# Altium schematic sheet Sensor_interfacing.SchDoc
size 76 x 76 mm; SheetNumber: 5; SheetTotal: 6
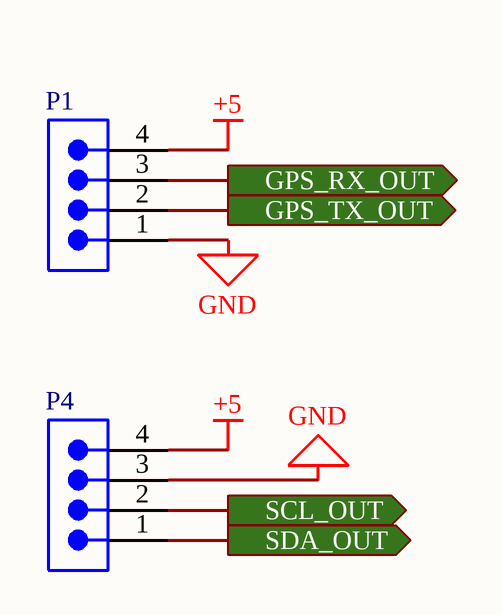
[diagram p0: Sensor_interfacing.SchDoc]

## Parts
P1  61300411121  [61300411121]  (value not drawn)
P4  61300411121  [61300411121]  (value not drawn)

## Ports
GPS_RX_OUT (out, see Top_domain[3C]), GPS_TX_OUT (out, see Top_domain[3D]), SCL_OUT (out, see Top_domain[3D]), SDA_OUT (out, see Top_domain[3D])

## Nets
+5: P1.4 P4.4
GND: P1.1 P4.3
GPS_RX_OUT: P1.3 ; port GPS_RX_OUT
GPS_TX_OUT: P1.2 ; port GPS_TX_OUT
SCL_OUT: P4.2 ; port SCL_OUT
SDA_OUT: P4.1 ; port SDA_OUT

## Library data of the parts
P1 P4 = CMP-1502-01064-2: NexarPartId: 32855522; Pitch: 2.54mm; Number of Contacts: 4; Contact Resistance: 20mΩ; Gender: Male; Current Rating: 3A; Connector Type: Male Pin; Voltage Rating: 250V; Lead Free: Lead Free; Contact Plating: Gold; Max Operating Temperature: 105°C; Packaging: Bulk; Height: 8.89mm; Orientation: Vertical; Contact Mating Length: 5.9944mm; Contact Material: Copper; Lead Pitch: 2.54mm; Min Operating Temperature: -40°C; Termination: Solder; Color: Black; Number of Rows: 1; REACH SVHC: Unknown; RoHS: Compliant; Mount: Through Hole; Number of Positions: 4; Number of Pins: 4; Operating Supply Voltage: 250V